# EAGLE design firestarter (EAGLE 7.2.0)
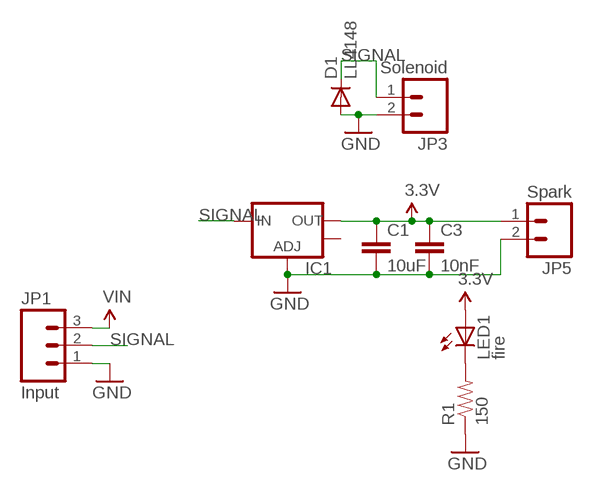
[diagram p0: schematic, sheet 1]

## Parts
C1  10uF  CAP0603-CAP  [0603-CAP]
C3  10nF  CAP0603-CAP  [0603-CAP]
D1  LL4148  [MLL34]
IC1  V_REG_LM1117SOT223  [SOT223]
JP1  Input  M03POLAR_LOCK  [MOLEX-1X3_LOCK]
JP3  Solenoid  M02POLAR_LOCK  [MOLEX-1X2_LOCK]
JP5  Spark  M02POLAR_LOCK  [MOLEX-1X2_LOCK]
LED1  fire  LED0603  [LED-0603]
R1  150  RESISTOR0603-RES  [0603-RES]

## Nets
3.3V: C1.1 C3.1 IC1.2(OUT) JP5.1 LED1.A
GND: C1.2 C3.2 D1.A IC1.1(ADJ) JP1.1 JP3.2 JP5.2 R1.1
N$1: LED1.C R1.2
SIGNAL: D1.C IC1.3(IN) JP1.2 JP3.1
VIN: JP1.3
Unconnected: IC1.4(OUT)

## Library data of the parts
C1 C3 = SparkFun-Capacitors:CAP: Capacitor Standard 0603 ceramic capacitor, and 0.1" leaded capacitor.
D1 = Discrete:LL4148
IC1 = SparkFun-PowerIC:V_REG_LM1117: Voltage Regulator LM1117 Standard adjustable voltage regulator but in SMD form. Spark Fun Electronics SKU : COM-00595
JP1 = SparkFun-Connectors:M03: Header 3 Standard 3-pin 0.1" header. Use with straight break away headers (SKU : PRT-00116), right angle break away headers (PRT-00553), swiss pins (PRT-00743), machine pins (PRT-00117), and female headers (PRT-00115). Molex polarized connector foot print use with SKU : PRT-08232 with associated crimp pins and housings.
JP3 JP5 = SparkFun-Connectors:M02: Standard 2-pin 0.1" header. Use with - straight break away headers ( PRT-00116) - right angle break away headers (PRT-00553) - swiss pins (PRT-00743) - machine pins (PRT-00117) - female headers (PRT-00115) Molex polarized connector foot print use with: PRT-08233 with associated crimp pins and housings. 2.54_SCREWTERM for use with PRT-10571. 3.5mm Screw Terminal footprints for PRT-08084 5mm Screw Terminal footprints for use with PRT-08433
LED1 = SparkFun-LED:LED: LEDs Standard schematic elements and footprints for 5mm, 3mm, 1206, and 0603 sized LEDs. 5mm - Spark Fun Electronics SKU : COM-00529 (and others)
R1 = SparkFun-Resistors:RESISTOR: Resistor Basic schematic elements and footprints for 0603, 1206, and PTH resistors.

## Net classes
0 default: clearance 0.205 mm

## Board
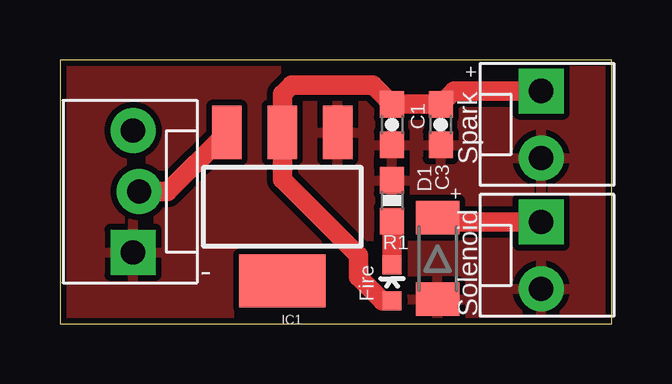
[diagram p1: board, top side]
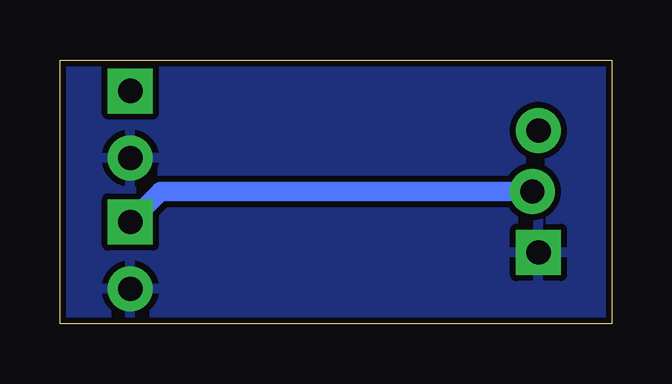
[diagram p2: board, bottom side, seen from below]

Size 23 x 11 mm. Coordinates in mm from the lower left corner, seen from the top.
Outline: 0,0 23,0 23,11 0,11 0,0
Copper layers (1*16): Top 0.035mm / dielectric 1.5mm / Bottom 0.035mm
Design rules "SeeedStudio_2layer_DRU_no_angle_20140221": minimum track width 6mil, minimum drill 12mil, track to track 6mil, track to pad 6mil, pad to pad 6mil, via to via 6mil, smd to smd 0mil, copper to edge 10mil, drill to drill 10mil, minimum pad ring 10mil, minimum via ring 6mil, stop-mask expansion 2mil, vias tented up to drill 100mil, thermal gap 10mil

### Footprints (pad centres in the part's own frame; a part is rotated, then mirrored left to right if it is on the bottom)
0603-CAP = smd 1.1 x 1: 1 -0.85,0; 2 0.85,0
MLL34 = smd 1.4 x 1.8: A 1.7,0; C -1.7,0
SOT223 = smd 1.219 x 2.235: 1 -2.311,-3.099; 2 0,-3.099; 3 2.311,-3.099 | smd 3.6 x 2.2: 4 0,3.099
MOLEX-1X3_LOCK = drill 1.016 pad 1.88 square: 1 0,0.127 | drill 1.016 pad 1.88: 2 2.54,-0.127; 3 5.08,0.127
MOLEX-1X2_LOCK = drill 1.016 pad 1.88 square: 1 -0.127,0 | drill 1.016 pad 1.88: 2 2.667,0
LED-0603 = smd 0.8 x 0.8: A 0,-0.75; C 0,0.75
0603-RES = smd 1.1 x 1: 1 -0.85,0; 2 0.85,0

### Placement (x,y rotation side)
C1  13.84,8.3 270 top
C3  15.88,8.3 270 top
D1  15.75,2.72 270 top
IC1  9.27,4.88 180 top
JP1  3.17,2.97 90 top
JP3  20.07,4.11 270 top
JP5  20.07,9.57 270 top
LED1  13.84,1.7 0 top
R1  13.84,5.13 270 top

### Tracks (layer width: path | path; a pad name or v marks a point on that pad's centre or on a via)
3.3V
  Top 0.813: JP5.1 16.42,9.7 C3.1 C1.1 13.04,9.95 9.65,9.95 9.27,9.57 IC1.2 9.27,6.02 12.45,2.84 12.45,1.95 13.45,0.95 LED1.A
GND
  pour Bottom (isolate 0.254): 0,11 23,11 23,-11 0,-11
  pour Top (isolate 0.254): 0,-11 23,-11 23,11 0,11
N$1
  Top 0.813: LED1.C R1.2
SIGNAL
  Top 0.813: D1.C 15.92,4.24 JP3.1 | JP1.2 4.5,5.51 IC1.3
  Bottom 0.813: JP3.1 18.8,5.51 JP1.2

### Text on the board
tNames: + | Spark | + | - | Fire | Solenoid